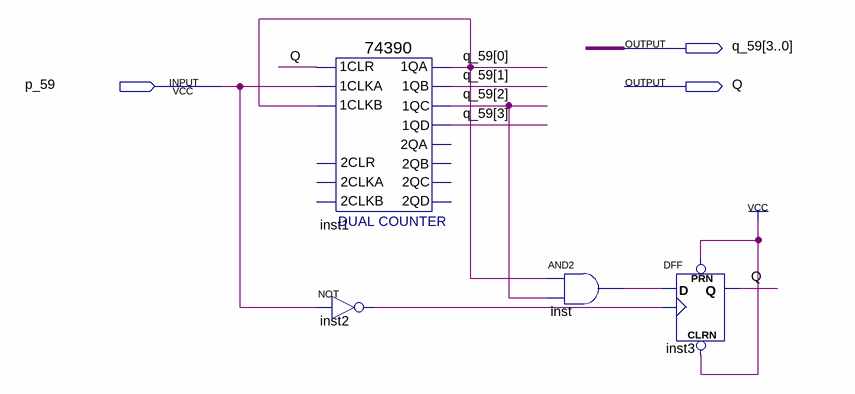
[diagram p0: schematic sheet]
// Quartus schematic cnt6.bdf as structural Verilog: 4 symbols, 3 pins
module cnt6 (
  input  p_59,
  output [3:0] q_59,
  output Q
);

  wire inst2_out, inst_out;

  \74390  inst1 (
    .\1CLR (Q), .\1CLKA (p_59), .\1CLKB (q_59[0]), .\1QA (q_59[0]), .\1QB (q_59[1]), .\1QC (q_59[2]),
    .\1QD (q_59[3]));  // open: 2CLKA, 2CLR, 2CLKB, 2QA, 2QB, 2QC, 2QD
  not inst2 (inst2_out, p_59);
  and inst (inst_out, q_59[0], q_59[2]);
  DFF inst3 (.CLRN(1'b1), .CLK(inst2_out), .D(inst_out), .PRN(1'b1), .Q(Q));
endmodule
